# Altium schematic sheet Lambda-Sensor-Driver.SchDoc
size A4
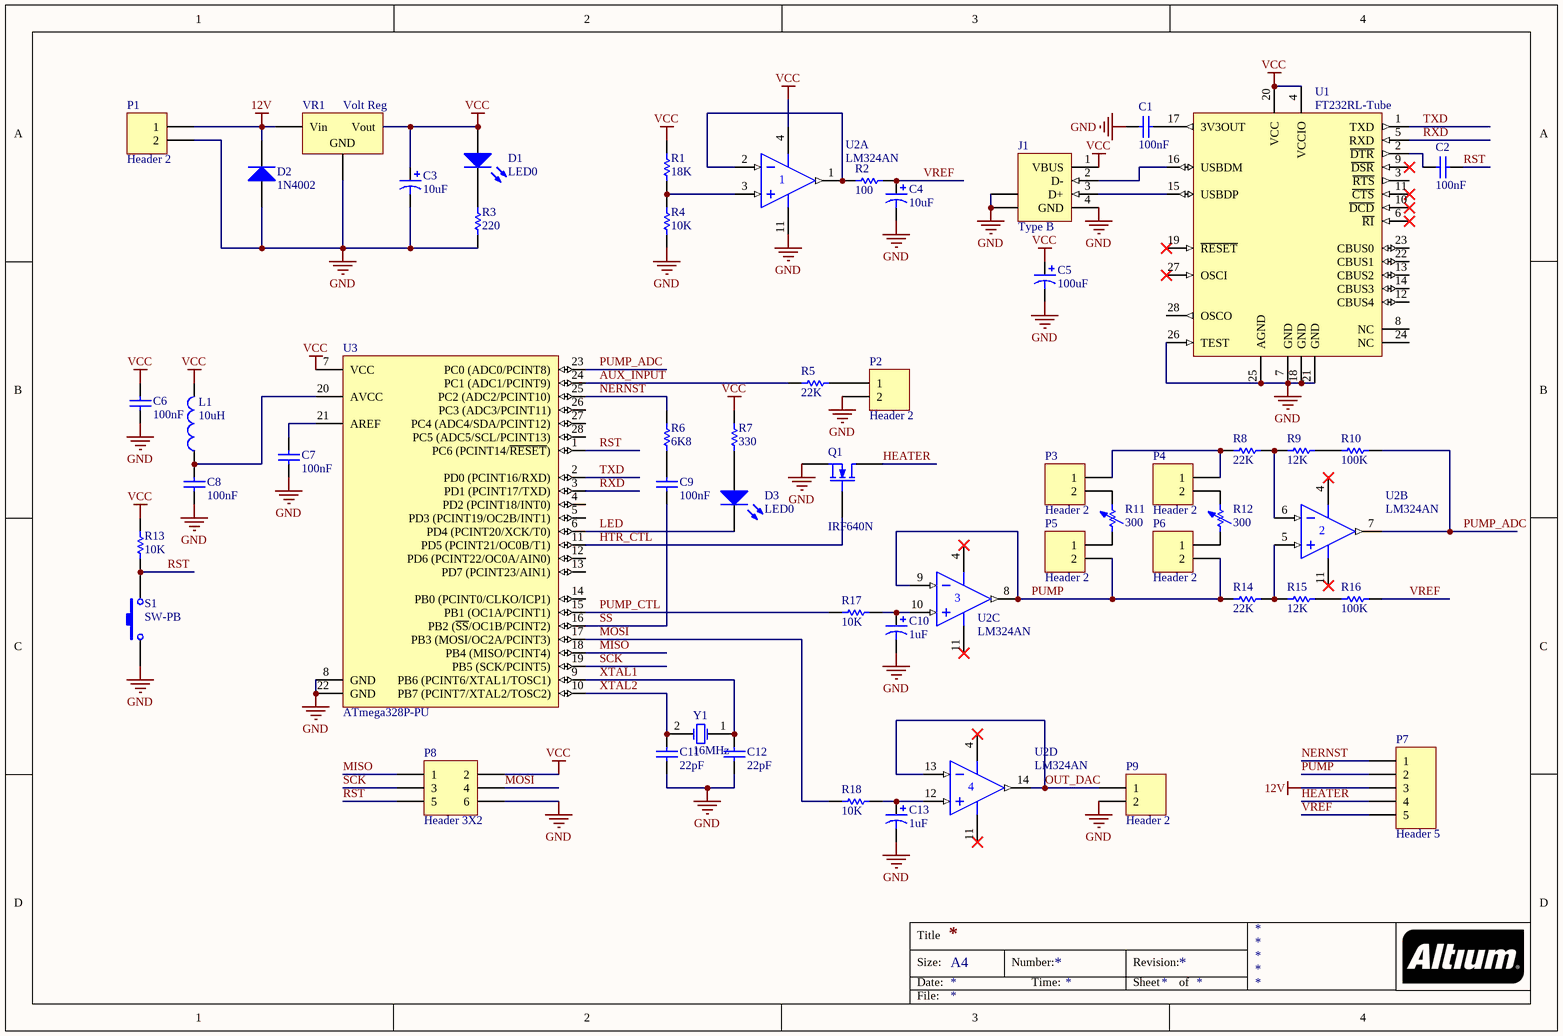
[diagram p0: Lambda-Sensor-Driver.SchDoc]

## Parts
C1  100nF  [C0805]
C2  100nF  [C0805]
C3  10uF  [E2,5-5]
C4  10uF  [E2,5-5]
C5  100uF  [E2,5-5]
C6  100nF  [C025-024X044]
C7  100nF  [C025-024X044]
C8  100nF  [C025-024X044]
C9  100nF  [C025-024X044]
C10  1uF  [E2,5-5]
C11  22pF  [C025-024X044]
C12  22pF  [C025-024X044]
C13  1uF  [E2,5-5]
D1  LED0  [LED3MM]
D2  1N4002  [DO41-10]
D3  LED0  [LED3MM]
J1  Type B  [USB-B-PTH]
L1  10uH  [0207/10]
P1  Header 2  [W237-132]
P2  Header 2  [W237-132]
P3  Header 2  [HDR1X2]
P4  Header 2  [HDR1X2]
P5  Header 2  [HDR1X2]
P6  Header 2  [HDR1X2]
P7  Header 5  [W237-6P]
P8  Header 3X2  [HDR2X3]
P9  Header 2  [W237-132]
Q1  IRF640N  [TO220V]
R1  18K  [0207/10]
R2  100  [0207/10]
R3  220  [0207/10]
R4  10K  [0207/10]
R5  22K  [0207/10]
R6  6K8  [0207/10]
R7  330  [0207/10]
R8  22K  [0207/10]
R9  12K  [0207/10]
R10  100K  [0207/10]
R11  300  [CA6V]
R12  300  [CA6V]
R13  10K  [0207/10]
R14  22K  [0207/10]
R15  12K  [0207/10]
R16  100K  [0207/10]
R17  10K  [0207/10]
R18  10K  [0207/10]
S1  SW-PB  [TACTILE-PTH]
U1  FT232RL-Tube  [SSOP-28_N]
U2  LM324AN  [646-06]  (parts A,B,C,D of 4)
U3  ATmega328P-PU  [28P3]
VR1  Volt Reg  [TO220V]
Y1  16MHz  [HC49US]

## Nets
12V: D2.2(K) P1.1 P7.3 VR1.1(Vin)
GND: C1.2 C3.2 C4.2 C5.2 C6.1 C7.1 C8.1 C10.2 C11.1 C12.1 C13.2 D2.1(A) J1.4(GND) J1.5(SHLD) J1.6(SHLD) P1.2 P2.2 P8.6 P9.2 Q1.3(S) R3.1 R4.1 S1.1 U1.7(GND) U1.18(GND) U1.21(GND) U1.25(AGND) U1.26(TEST) U2.11(V-) U3.8(GND) U3.22(GND) VR1.2(GND)
VCC: C3.1 C5.1 C6.2 D1.1(A) J1.1(VBUS) L1.2 P8.2 R1.2 R7.1 R13.1 U1.4(VCCIO) U1.20(VCC) U2.4(V+) U3.7(VCC) VR1.3(Vout)
AUX_INPUT: R5.2 U3.24(PC1_(ADC1/PCINT9))
HEATER: P7.4 Q1.2(D)
HTR_CTL: Q1.1(G) U3.11(PD5_(PCINT21/OC0B/T1))
LED: D3.2(K) U3.6(PD4_(PCINT20/XCK/T0))
MISO: P8.1 U3.18(PB4_(MISO/PCINT4))
MOSI: P8.4 R18.1 U3.17(PB3_(MOSI/OC2A/PCINT3))
NERNST: P7.1 R6.1 U3.25(PC2_(ADC2/PCINT10))
OUT_DAC: P9.1 U2.13(IN-) U2.14(OUT)
PUMP: P5.2 P6.2 P7.2 R14.2 U2.8(OUT) U2.9(IN-)
PUMP_ADC: R10.1 U2.7(OUT) U3.23(PC0_(ADC0/PCINT8))
PUMP_CTL: R17.1 U3.15(PB1_(OC1A/PCINT1))
RST: C2.1 P8.5 R13.2 S1.2 U3.1(PC6_(PCINT14/~{RESET}))
RXD: U1.5(RXD) U3.3(PD1_(PCINT17/TXD))
SCK: P8.3 U3.19(PB5_(SCK/PCINT5))
SS: C9.1 U3.16(PB2_(~{SS}/OC1B/PCINT2))
TXD: U1.1(TXD) U3.2(PD0_(PCINT16/RXD))
VREF: C4.1 P7.5 R2.1 R16.1
XTAL1: C12.2 U3.9(PB6_(PCINT6/XTAL1/TOSC1)) Y1.1(OSC1)
XTAL2: C11.2 U3.10(PB7_(PCINT7/XTAL2/TOSC2)) Y1.2(OSC2)
NetC1_1: C1.1 U1.17(3V3OUT)
NetC2_2: C2.2 U1.2(~{DTR})
NetC7_2: C7.2 U3.21(AREF)
NetC8_2: C8.2 L1.1 U3.20(AVCC)
NetC9_2: C9.2 R6.2
NetC10_1: C10.1 R17.2 U2.10(IN+)
NetC13_1: C13.1 R18.2 U2.12(IN+)
NetD1_2: D1.2(K) R3.2
NetD3_1: D3.1(A) R7.2
NetJ1_2: J1.2(D-) U1.16(USBDM)
NetJ1_3: J1.3(D+) U1.15(USBDP)
NetP2_1: P2.1 R5.1
NetP3_1: P3.1 P4.1 R8.2
NetP3_2: P3.2 R11.2
NetP4_2: P4.2 R12.2
NetP5_1: P5.1 R11.1
NetP6_1: P6.1 R12.1
NetR1_1: R1.1 R4.2 U2.3(IN+)
NetR2_2: R2.2 U2.1(OUT) U2.2(IN-)
NetR8_1: R8.1 R9.2 U2.6(IN-)
NetR9_1: R9.1 R10.2
NetR14_1: R14.1 R15.2 U2.5(IN+)
NetR15_1: R15.1 R16.2

Not connected (* = marked no-connect by the designer): U1 3(~{RTS}) 6(~{RI})* 8(NC) 9(~{DSR})* 10(~{DCD})* 11(~{CTS})* 12(CBUS4) 13(CBUS2) 14(CBUS3) 19(~{RESET})* 22(CBUS1) 23(CBUS0) 24(NC) 27(OSCI)* 28(OSCO); U3 4(PD2_(PCINT18/INT0)) 5(PD3_(PCINT19/OC2B/INT1)) 12(PD6_(PCINT22/OC0A/AIN0)) 13(PD7_(PCINT23/AIN1)) 14(PB0_(PCINT0/CLKO/ICP1)) 26(PC3_(ADC3/PCINT11)) 27(PC4_(ADC4/SDA/PCINT12)) 28(PC5_(ADC5/SCL/PCINT13))

## Notes on the sheet
- Title
- Size:
- Date:
- A4
- Number:
- Time:
- Revision:
- Sheet
- of
- File:

## Library data of the parts
C1 C2 C6-C9 C11 C12 = Cap: Capacitor; Published: 8-Jun-2000; LatestRevisionDate: 17-Jul-2002; LatestRevisionNote: Re-released for DXP Platform.; PackageReference: RAD-0.3; Publisher: Altium Limited; PackageDescription: Radial Cap, Thru-Hole; 2 Leads; 0.3 in Pin Spacing
  C1 C2 C6-C9: Value: 100nF
  C11 C12: Value: 22pF
C3-C5 C10 C13 = Cap Pol1: Polarized Capacitor (Radial); Published: 8-Jun-2000; LatestRevisionDate: 17-Jul-2002; LatestRevisionNote: Re-released for DXP Platform.; PackageReference: RB7.6-15; Publisher: Altium Limited; PackageDescription: Polarized Capacitor (Radial); 2 Leads
  C3 C4: Value: 10uF
  C5: Value: 100uF
  C10 C13: Value: 1uF
D1 D3 = LED0: Typical INFRARED GaAs LED; Published: 8-Jun-2000; LatestRevisionDate: 08-Jul-2005; LatestRevisionNote: Mech Layer 1 removed.; PackageReference: LED-0; Publisher: Altium Limited; PackageDescription: LED; 2 Leads
D2 = Diode: Default Diode; Published: 8-Jun-2000; LatestRevisionDate: 17-Jul-2002; LatestRevisionNote: Re-released for DXP Platform.; PackageVersion: Sep-1996; PackageReference: SMC; Publisher: Altium Limited; PackageDescription: DO-214-AB/SMC; 2 C-Bend Leads; Body 7.9 x 5.9 mm, inc. leads (LxW); Code_JEDEC: DO-214-AB
J1 = USB: Value: Type B; Category: Connector; Type: USB; Price: 2250; Link: http://www.sfe-electronics.com/product.php?category=12&product_id=156
L1 = Inductor: Code_IEC: 1005; Published: 8-Jun-2000; LatestRevisionDate: 29-May-2009; LatestRevisionNote: IPC-7351 Footprint Added.; PackageReference: 0402-A; Publisher: Altium Limited; PackageDescription: Chip Inductor; Code_JEITA: 0402; Value: 10uH
P1-P6 P9 = Header 2: Header, 2-Pin; LatestRevisionDate: 17-Jul-2002; LatestRevisionNote: Re-released for DXP Platform.; Publisher: Altium Limited
P7 = Header 5: Header, 5-Pin; LatestRevisionDate: 17-Jul-2002; LatestRevisionNote: Re-released for DXP Platform.; Publisher: Altium Limited
P8 = Header 3X2: Header, 3-Pin, Dual row; LatestRevisionDate: 17-Jul-2002; LatestRevisionNote: Re-released for DXP Platform.; Publisher: Altium Limited
Q1 = MOSFET-N: N-Channel MOSFET; Published: 8-Jun-2000; LatestRevisionDate: 17-Jul-2002; LatestRevisionNote: Re-released for DXP Platform.; PackageVersion: 1995/1996; PackageReference: E3; Publisher: Altium Limited; PackageDescription: TO, Flat Index; 3 In-Line, Axial Leads; Body Dia. 4.6mm; Lead Dia. 0.5 mm (max)
R1-R10 R13-R18 = Res1: Resistor; Published: 8-Jun-2000; LatestRevisionDate: 17-Jul-2002; LatestRevisionNote: Re-released for DXP Platform.; PackageReference: AXIAL-0.3; Publisher: Altium Limited; PackageDescription: Axial Device, Thru-Hole; 2 Leads; 0.3 in Pin Spacing
  R1: Value: 18K
  R2: Value: 100
  R3: Value: 220
  R4 R13 R17 R18: Value: 10K
  R5 R8 R14: Value: 22K
  R6: Value: 6K8
  R7: Value: 330
  R9 R15: Value: 12K
  R10 R16: Value: 100K
R11 R12 = Res Adj1: Variable Resistor; Set Position: 0.5; Published: 8-Jun-2000; LatestRevisionDate: 17-Jul-2002; LatestRevisionNote: Re-released for DXP Platform.; PackageReference: AXIAL-0.7; Publisher: Altium Limited; PackageDescription: Axial Device, Thru-Hole; 2 Leads; 0.7 in Pin Spacing; Value: 300
S1 = SW-PB: Switch; Published: 24-Mar-1999; LatestRevisionDate: 17-Jul-2002; LatestRevisionNote: Re-released for DXP Platform.; PackageReference: SPST-2; Publisher: Altium Limited; PackageDescription: Switch; 2 Leads
U1 = FT232RL-Tube: USB UART Asynchronous Serial Data Transfer Chip, SSOP-28, Tube; Published: 19-Aug-2010; DatasheetVersion: ver 2.07, Jul-2010; PackageVersion: 2010; PackageReference: SSOP-28; Publisher: Altium Limited; PackageDescription: 28-Pin Small Outline Package 0.65 mm Pitch; ComponentLink1Description: Manufacturer Link; ComponentLink1URL: http://www.ftdichip.com/Products/ICs/FT232R.htm; ComponentLink2Description: Datasheet; ComponentLink2URL: http://www.ftdichip.com/Support/Documents/DataSheets/ICs/DS_FT232R.pdf
U2 = LM324AN: Quad Low-Power Operational Amplifier; Published: 17-Jul-2002; LatestRevisionDate: 06-Jun-2005; LatestRevisionNote: Stylized 3D Model Added.; DatasheetVersion: 1988; PackageVersion: 1997; PackageReference: 646-06; Publisher: Altium Limited; PackageDescription: DIP; 14 Leads; Row Spacing 7.62 mm; Pitch 2.54 mm; ComponentLink1Description: Manufacturer Link; ComponentLink1URL: http://www.onsemi.com/site/products/parametrics/0,4446,251,00.html; ComponentLink2Description: Datasheet; ComponentLink2URL: http://www.onsemi.com/pub/Collateral/LM324-D.PDF
U3 = ATmega328P-PU: 8-bit AVR Microcontroller, 32KB Flash, 1KB EEPROM, 2KB SRAM, 28-pin PDIP, Industrial Grade (-40°C to 85°C); Published: 1-Apr-2010; DatasheetVersion: revA, Jan-2010; PackageVersion: revB, Sep-2001; PackageReference: 28P3; Publisher: Altium Limited; PackageDescription: 28-lead (0.300"/7.62mm Wide) Plastic Dual Inline Package (PDIP); Supplier 1: Digi-Key; Supplier Part Number 1: ATMEGA328P-PU-ND; Supplier 2: Farnell; Supplier Part Number 2: 1715487; Supplier 3: Mouser; Supplier Part Number 3: 556-ATMEGA328P-PU; ComponentLink1Description: Manufacturer Link; ComponentLink1URL: http://www.atmel.com/products/avr/default.asp?; ComponentLink2Description: ATmega48A/48PA/88A/88PA/168A/168PA/328/328P Datasheet; ComponentLink2URL: http://www.atmel.com/dyn/resources/prod_documents/8271.pdf; ComponentLink3Description: ATmega48A/48PA/88A/88PA/168A/168PA/328/328P Summary; ComponentLink3URL: http://www.atmel.com/dyn/resources/prod_documents/8271S.pdf; ComponentLink4Description: Atmel.com Home; ComponentLink4URL: http://www.atmel.com
VR1 = Volt Reg: Voltage Regulator; Published: 24-Mar-1999; LatestRevisionDate: 29-May-2009; LatestRevisionNote: IPC-7351 Footprint Added.; PackageReference: D2PAK; Publisher: Altium Limited; PackageDescription: 3-Pin Transistor Outline Package 2.54 mm Pitch, 15.1 mm Lead Span
Y1 = XTAL: Crystal Oscillator; Published: 8-Jun-2000; LatestRevisionDate: 17-Jul-2002; LatestRevisionNote: Re-released for DXP Platform.; PackageReference: R38; Publisher: Altium Limited; PackageDescription: Crystal, Thru-Hole; 2 Leads; Body 3.1 x 8.2 mm (Dia.xH)